# EasyEDA Pro project Propj-AlmuxCybernet.epro, board RPB2026PCB
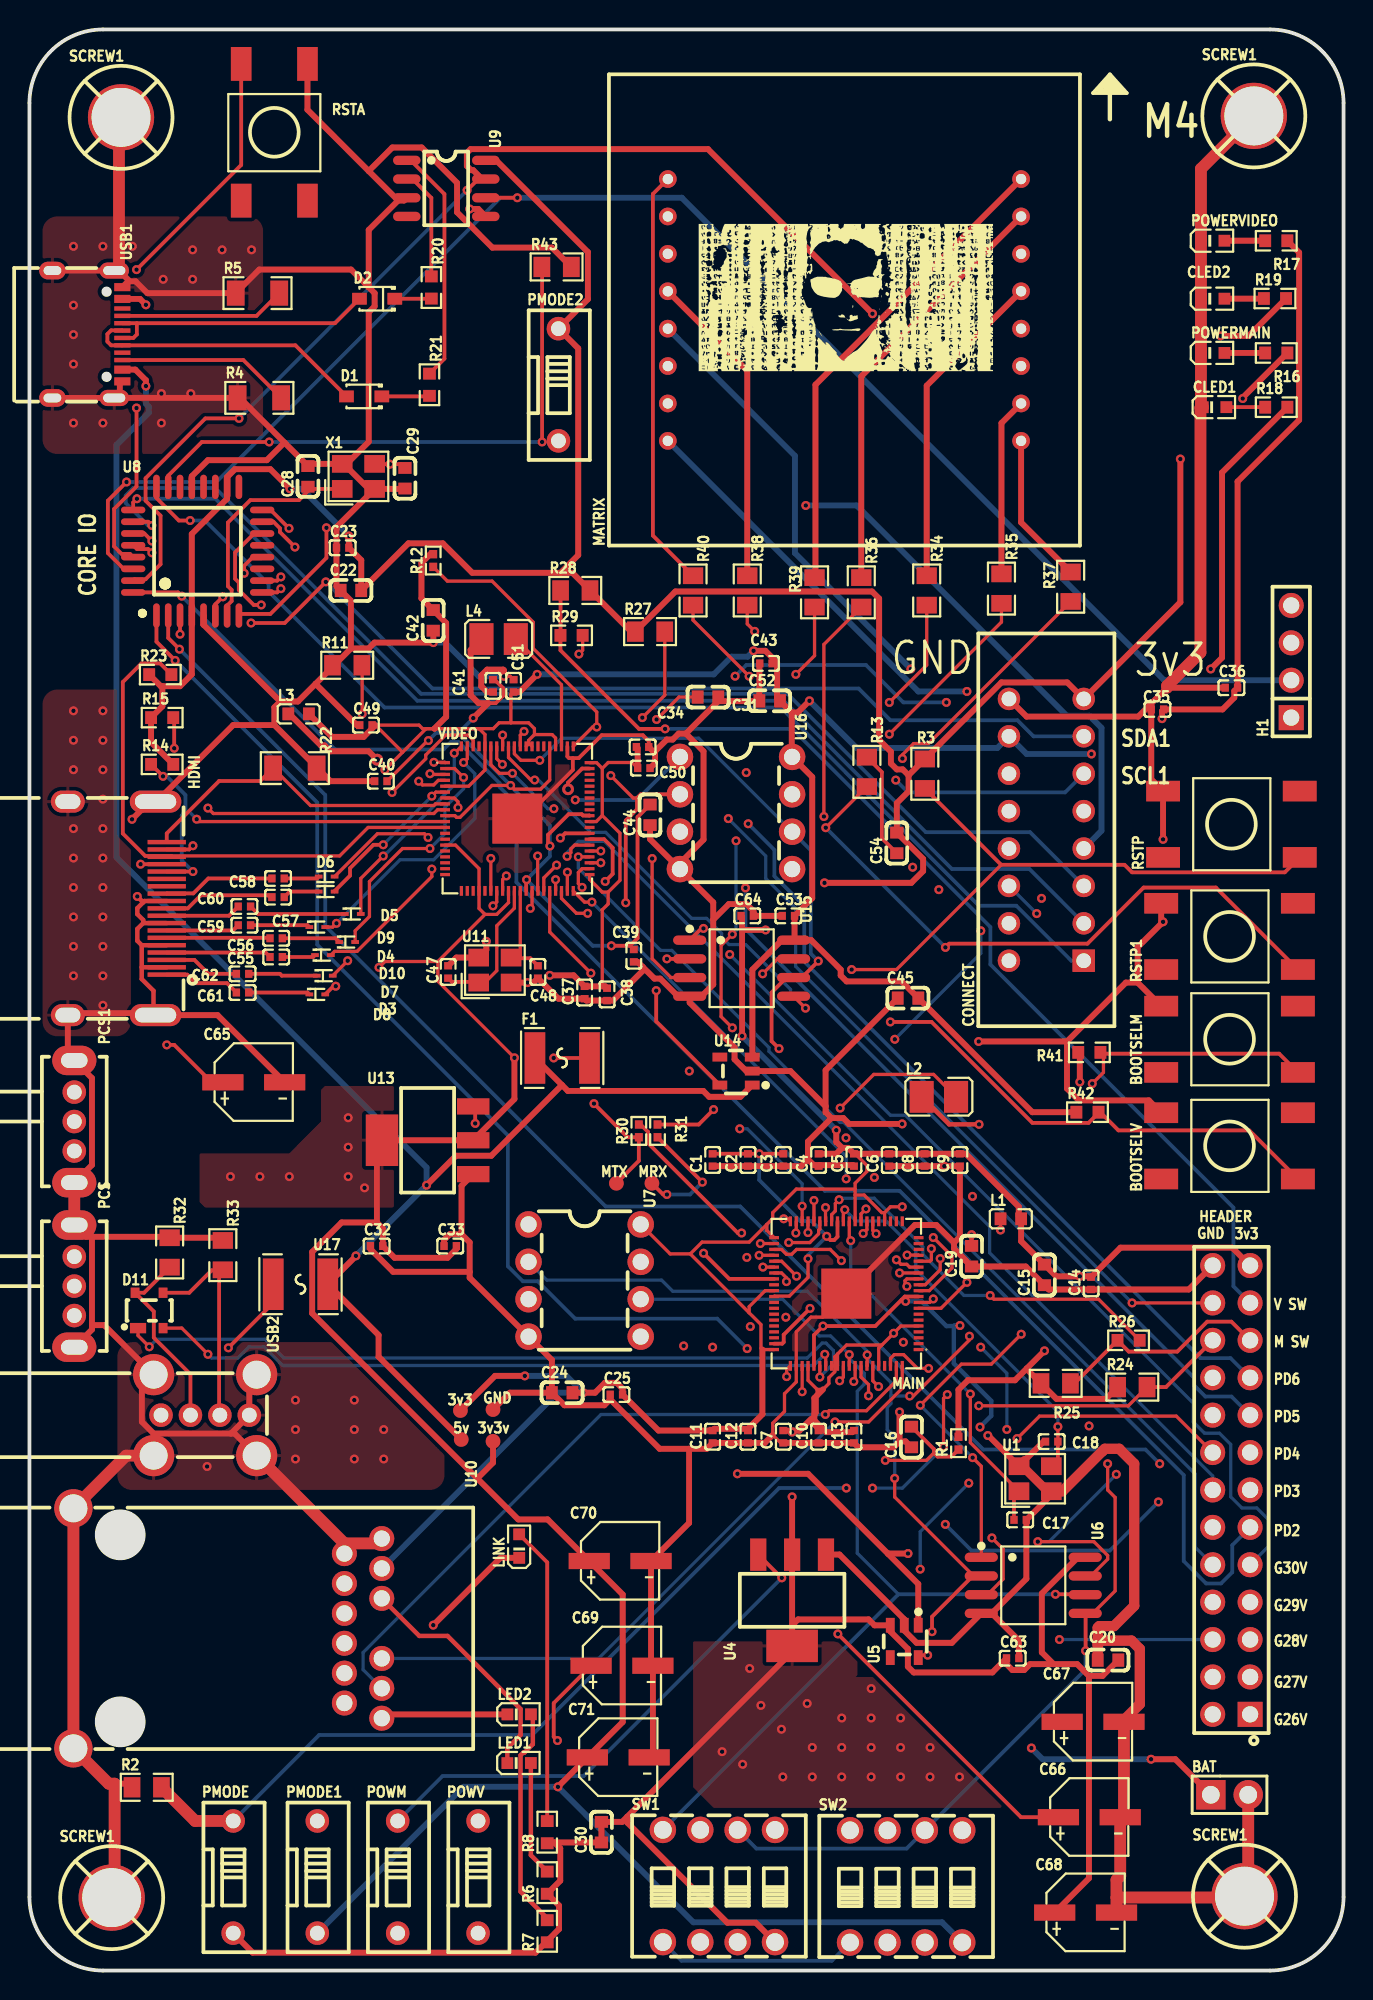
[diagram p2: board, top side]
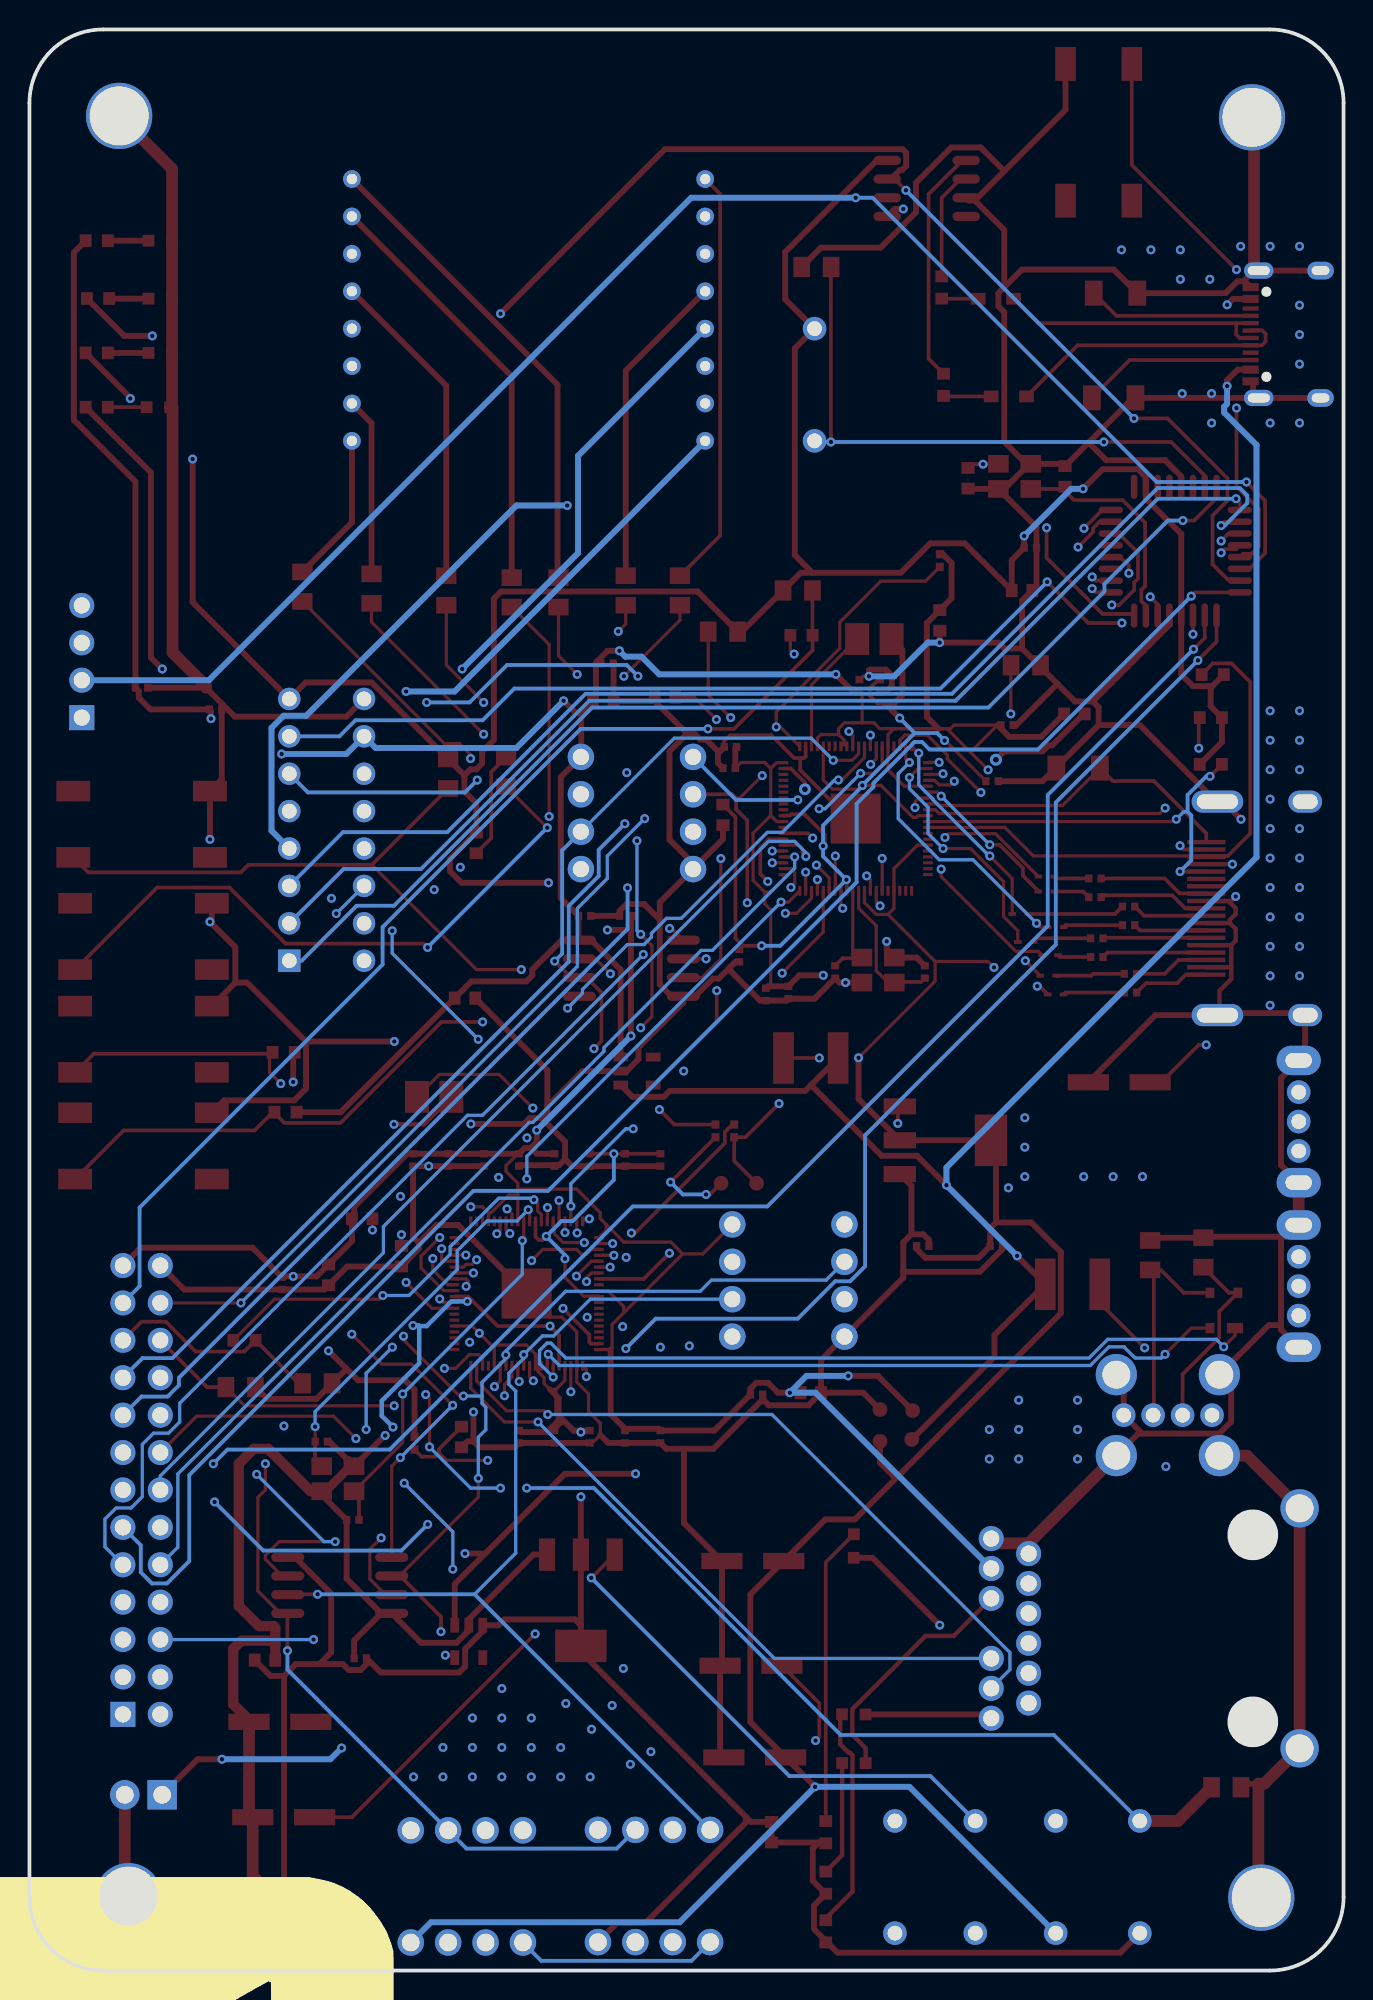
[diagram p3: board, bottom side, seen from below]

Outline 89.28 x 131.83 mm; copper layers: Top Layer, Inner1, Inner2, Inner3, Inner4, Bottom Layer. Coordinates in mm from the lower left corner of the outline.
Outline path: 0,126.83 0,5 arc(1.46,1.46) 5,0 84.28,0 arc(87.82,1.46) 89.28,5 89.28,126.83 arc(87.82,130.36) 84.28,131.83 5,131.83 arc(1.46,130.36) 0,126.83
Stack: Top Layer 0.035mm Outer layer thickness 1oz / Dielectric1 0.0994mm 3313 RC57% 4.2mil / Inner1 0.0152mm Inner layer thickness / Dielectric2 0.55mm 0.55mm H/H No copper / Inner2 0.0152mm Inner layer thickness / Dielectric3 0.1088mm 2116 RC54% 4.9mil / Inner3 0.0152mm Inner layer thickness / Dielectric4 0.55mm 0.55mm H/H No copper / Inner4 0.0152mm Inner layer thickness / Dielectric5 0.0994mm 3313 RC57% 4.2mil / Bottom Layer 0.035mm Outer layer thickness 1oz

## Design rules (mm)
template: Custom Config
spacing copperThickness1oz (default): track to track 0.102, other pairs 0.152 to 0.3
spacing copperThickness2oz: track to track 0.203, other pairs 0.152 to 0.3
track width copperThickness1oz (default): min 0.127, default 0.254, max 2.54
track width copperThickness2oz: min 0.203, default 0.254, max 2.54
track width Power: min 0.22, default 0.4, max 2.54
differential pair differentialPair (default): width min 0.127, default 0.254, max 2.54; gap min 0.152, default 0.152
via viaSize (default): diameter min 0.5, default 0.61, max 10; hole min 0.3, default 0.305, max 6.3
net GND uses Power
net 3V3 uses Power
net 3V3V uses Power
net +5V uses Power

## Placement (name value [footprint] x y rotation side)
3v3  -  [Test-Point-0.5mm]  29.28 38.03 0 top
3v3v  -  [Test-Point-0.5mm]  31.5 35.94 0 top
5v  -  [Test-Point-0.5mm]  29.34 36.07 0 top
BAT  PZ254V-11-02P  [HDR-TH_2P-P2.54-V-M]  81.53 11.94 0 top
BOOTSELM  K2-1102SP-A4SC-04  [KEY-SMD_4P-L6.0-W6.0-P4.50-LS10.0]  81.53 63.25 90 top
BOOTSELV  K2-1102SP-A4SC-04  [KEY-SMD_4P-L6.0-W6.0-P4.50-LS10.0]  81.53 56.01 90 top
C1  0.1u  [C0402]  46.42 55.05 90 top
C2  0.1u  [C0402]  48.82 55.05 90 top
C3  0.1u  [C0402]  51.22 55.05 90 top
C4  0.1u  [C0402]  53.62 55.05 90 top
C5  0.1u  [C0402]  56.02 55.05 90 top
C6  0.1u  [C0402]  58.42 55.05 90 top
C7  0.1u  [C0402]  51.22 36.25 90 top
C8  0.1u  [C0402]  60.82 55.05 90 top
C9  0.1u  [C0402]  63.22 55.05 90 top
C10  0.1u  [C0402]  53.62 36.25 90 top
C11  0.1u  [C0402]  46.42 36.25 90 top
C12  0.1u  [C0402]  48.82 36.25 90 top
C13  0.1u  [C0402]  56.02 36.25 90 top
C14  0.1u  [C0402]  72.13 46.67 90 top
C15  4.7u  [C0603]  68.96 47.24 90 top
C16  4.7u  [C0603]  59.92 36.24 90 top
C17  10p  [C0402]  67.31 30.61 180 top
C18  10p  [C0402]  69.45 35.92 0 top
C19  4.7uF  [C0603]  64.01 48.51 90 top
C20  4.7u  [C0603]  73.28 21.08 0 top
C22  4.7u  [C0603]  21.84 93.73 0 top
C23  0.1u  [C0402]  21.28 96.63 0 top
C24  4.7u  [C0603]  36.2 39.24 0 top
C25  0.1u  [C0402]  39.88 39.12 0 top
C28  15pF  [C0603]  18.92 101.47 90 top
C29  15pF  [C0603]  25.51 101.35 270 top
C30  4.7uF  [C0603]  38.86 9.4 90 top
C31  4.7u  [C0603]  46.1 86.49 180 top
C32  0.1u  [C0402]  23.59 49.2 0 top
C33  0.1u  [C0402]  28.59 49.2 0 top
C34  0.1u  [C0402]  41.66 83.1 180 top
C35  0.1u  [C0402]  76.64 85.65 0 top
C36  0.1u  [C0402]  81.66 87.12 0 top
C37  0.1u  [C0402]  37.72 66.42 90 top
C38  0.1u  [C0402]  39.24 66.29 90 top
C39  0.1u  [C0402]  41.06 68.92 90 top
C40  0.1u  [C0402]  23.88 80.77 0 top
C41  0.1u  [C0402]  31.5 87.25 90 top
C42  4.7u  [C0603]  27.43 91.69 90 top
C43  0.1u  [C0402]  50.04 88.77 0 top
C44  4.7uF  [C0603]  42.16 78.49 90 top
C45  4.7u  [C0603]  59.69 66.04 0 top
C47  10p  [C0402]  28.45 67.82 270 top
C48  10p  [C0402]  34.54 67.82 90 top
C49  0.1u  [C0402]  22.86 84.58 0 top
C50  0.1u  [C0402]  41.74 81.66 180 top
C51  0.1u  [C0402]  32.89 87.25 270 top
C52  4.7u  [C0603]  50.29 86.23 0 top
C53  0.1u  [C0402]  51.56 71.63 0 top
C54  4.7uF  [C0603]  58.93 76.58 90 top
C55  0.1uF  [C0402]  16.76 68.83 180 top
C56  0.1uF  [C0402]  16.76 70.1 180 top
C57  0.1uF  [C0402]  16.89 72.9 180 top
C58  0.1uF  [C0402]  16.89 74.17 180 top
C59  0.1uF  [C0402]  14.61 70.99 0 top
C60  0.1uF  [C0402]  14.61 72.26 0 top
C61  0.1uF  [C0402]  14.48 66.42 0 top
C62  0.1uF  [C0402]  14.48 67.69 0 top
C63  100nF  [C0402]  66.8 21.21 0 top
C64  100nF  [C0402]  48.77 71.63 0 top
C65  10uF  [CAP-SMD_BD5.0-L5.3-W5.3-FD]  15.24 60.33 0 top
C66  10uF  [CAP-SMD_BD5.0-L5.3-W5.3-FD]  72.01 10.41 0 top
C67  10uF  [CAP-SMD_BD5.0-L5.3-W5.3-FD]  72.26 16.89 0 top
C68  10uF  [CAP-SMD_BD5.0-L5.3-W5.3-FD]  71.76 3.94 0 top
C69  10uF  [CAP-SMD_BD5.0-L5.3-W5.3-FD]  40.26 20.7 0 top
C70  10uF  [CAP-SMD_BD5.0-L5.3-W5.3-FD]  40.13 27.81 0 top
C71  10uF  [CAP-SMD_BD5.0-L5.3-W5.3-FD]  40.01 14.48 0 top
CLED1  XL-1608UGC-04  [LED0603-RD_GREEN]  80.52 106.17 0 top
CLED2  XL-1608UGC-04  [LED0603-RD_GREEN]  80.39 113.54 0 top
CONNECT  ED16BGFBK  [CONN-TH_ED16BGFBK]  69.09 77.47 90 top
D1  SD05  [SOD-323_L1.8-W1.3-LS2.5-FD]  22.74 106.9 0 top
D2  SD05  [SOD-323_L1.8-W1.3-LS2.5-FD]  23.62 113.54 0 top
D3  ESD9L5.0ST5G  [SOD-923_L0.8-W0.6-LS1.0-RD]  19.94 68.96 0 top
D4  ESD9L5.0ST5G  [SOD-923_L0.8-W0.6-LS1.0-RD]  21.59 69.85 0 top
D5  ESD9L5.0ST5G  [SOD-923_L0.8-W0.6-LS1.0-RD]  20.19 73.28 0 top
D6  ESD9L5.0ST5G  [SOD-923_L0.8-W0.6-LS1.0-RD]  20.19 74.3 0 top
D7  ESD9L5.0ST5G  [SOD-923_L0.8-W0.6-LS1.0-RD]  20.07 67.56 0 top
D8  ESD9L5.0ST5G  [SOD-923_L0.8-W0.6-LS1.0-RD]  19.56 66.29 0 top
D9  ESD9L5.0ST5G  [SOD-923_L0.8-W0.6-LS1.0-RD]  21.97 71.75 0 top
D10  ESD9L5.0ST5G  [SOD-923_L0.8-W0.6-LS1.0-RD]  19.56 70.87 0 top
D11  PRTR5V0U2X  [SOT-143_L2.9-W1.3-P1.92-LS2.3-BL]  8.13 44.83 0 top
F1  MF-MSMF010-2  [F1812]  36.2 61.98 0 top
GND  -  [Test-Point-0.5mm]  31.5 38.1 0 top
H1  PZ254V-11-04P  [HDR-TH_4P-P2.54-V-M]  85.73 88.9 90 top
HDMI  HDMI-001S  [HDMI-SMD_HDMI-001S]  5.97 72.14 270 top
HEADER  PM254-2-13-Z-8.5  [HDR-TH_26P-P2.54-V-F-R2-C13-S2.54-1]  81.66 32.64 90 top
L1  600Ω  [L0603]  66.67 51.05 0 top
L2  3.3uH  [L1008]  61.79 59.33 0 top
L3  600Ω  [L0603]  18.29 85.34 0 top
L4  3.3uH  [L1008]  31.88 90.42 0 top
LED1  XL-1608UGC-04  [LED0603-RD_GREEN]  33.27 14.09 0 top
LED2  XL-1608UGC-04  [LED0603-RD_GREEN]  33.27 17.4 0 top
LINK  XL-1608UGC-04  [LED0603-RD_GREEN]  33.27 28.83 90 top
MAIN  RP2350B  [QFN-80_L10.0-W10.0-P0.40-TL-EP3.4]  55.5 45.97 180 top
MATRIX  SZ421288N/64  [LED-SEG-TH_SZ421288N-64]  55.37 112.78 90 top
MRX  -  [Test-Point-0.5mm]  42.29 53.47 0 top
MTX  -  [Test-Point-0.5mm]  39.88 53.47 0 top
PCS  SK12D07VG5  [SW-TH_SK12D07VG5-1]  3.05 46.48 270 top
PCS1  SK12D07VG5  [SW-TH_SK12D07VG5-1]  3.05 57.66 270 top
PMODE  DSWB01LHGET  [SW-TH_DSWB01LHGET]  13.84 6.35 0 top
PMODE1  DSWB01LHGET  [SW-TH_DSWB01LHGET]  19.56 6.35 0 top
PMODE2  DSWB01LHGET  [SW-TH_DSWB01LHGET]  35.94 107.7 0 top
POWERMAIN  XL-1608UGC-04  [LED0603-RD_GREEN]  80.39 109.86 0 top
POWERVIDEO  XL-1608UGC-04  [LED0603-RD_GREEN]  80.39 117.47 0 top
POWM  DSWB01LHGET  [SW-TH_DSWB01LHGET]  25.02 6.35 0 top
POWV  DSWB01LHGET  [SW-TH_DSWB01LHGET]  30.48 6.35 0 top
R1  33  [R0402]  63.12 35.81 90 top
R2  10kΩ  [R0805]  7.97 12.45 0 top
R3  10kΩ  [R0805]  60.83 81.28 270 top
R4  5.1kΩ  [R1206]  15.62 106.81 0 top
R5  5.1kΩ  [R1206]  15.49 113.92 0 top
R6  330Ω  [R0603]  35.18 5.97 90 top
R7  330Ω  [R0603]  35.18 2.67 90 top
R8  330Ω  [R0603]  35.18 9.4 90 top
R11  10kΩ  [R0805]  21.59 88.65 0 top
R12  33Ω  [R0402]  27.43 95.76 90 top
R13  10kΩ  [R0805]  56.9 81.41 270 top
R14  4.7kΩ  [R0603]  9.02 81.92 0 top
R15  4.7kΩ  [R0603]  9.02 85.09 0 top
R16  330Ω  [R0603]  84.71 109.86 180 top
R17  330Ω  [R0603]  84.71 117.47 180 top
R18  330Ω  [R0603]  84.71 106.17 0 top
R19  330Ω  [R0603]  84.62 113.55 0 top
R20  22Ω  [R0603]  27.31 114.3 270 top
R21  22Ω  [R0603]  27.18 107.7 270 top
R22  100kΩ  [R1206]  18.03 81.66 180 top
R23  4.7kΩ  [R0603]  8.89 88.01 0 top
R24  10kΩ  [R0805]  74.93 39.62 0 top
R25  10kΩ  [R0805]  69.72 39.88 180 top
R26  33Ω  [R0603]  74.68 42.8 0 top
R27  10kΩ  [R0805]  42.16 90.93 0 top
R28  10kΩ  [R0805]  37.08 93.73 0 top
R29  33Ω  [R0603]  36.83 90.68 0 top
R30  33Ω  [R0402]  41.4 57.02 90 top
R31  33Ω  [R0402]  42.67 57.02 90 top
R32  15kΩ  [R0805]  9.53 48.77 270 top
R33  15kΩ  [R0805]  13.14 48.58 270 top
R34  150Ω  [R0805]  60.96 93.73 270 top
R35  150Ω  [R0805]  66.04 93.85 270 top
R36  150Ω  [R0805]  56.52 93.6 270 top
R37  150Ω  [R0805]  70.74 93.98 270 top
R38  150Ω  [R0805]  48.77 93.73 270 top
R39  150Ω  [R0805]  53.34 93.6 270 top
R40  150Ω  [R0805]  45.08 93.73 270 top
R41  1kΩ  [R0603]  72.01 62.36 0 top
R42  1kΩ  [R0603]  71.88 58.29 0 top
R43  10kΩ  [R0805]  35.81 115.7 0 top
RSTA  K2-1102SP-A4SC-04  [KEY-SMD_4P-L6.0-W6.0-P4.50-LS10.0]  16.64 124.84 0 top
RSTP  K2-1102SP-A4SC-04  [KEY-SMD_4P-L6.0-W6.0-P4.50-LS10.0]  81.66 77.85 90 top
RSTP1  K2-1102SP-A4SC-04  [KEY-SMD_4P-L6.0-W6.0-P4.50-LS10.0]  81.53 70.23 90 top
SCREW1  -  [Screw-Hole-M4]  6.22 125.86 0 top
SCREW1#2  -  [Screw-Hole-M4]  83.18 125.95 0 top
SCREW1#3  -  [Screw-Hole-M4]  82.55 5.05 0 top
SCREW1#4  -  [Screw-Hole-M4]  5.59 4.95 0 top
SW1  DSWB04LHGET  [SW-TH_DSWB04LHGET]  46.85 5.74 0 top
SW2  DSWB04LHGET  [SW-TH_DSWB04LHGET]  59.56 5.72 0 top
U1  3225-16M-SR  [CRYSTAL-SMD_4P-L3.2-W2.5-BL]  68.33 33.4 0 top
U4  TLV1117LV33DCYR  [SOT-223_L6.7-W3.5-P2.30-BR]  51.82 25.15 90 top
U5  TLV73311PDBVR  [SOT-23-5_L2.9-W1.6-P0.95-LS2.8-BR]  59.44 22.35 90 top
U6  W25Q16JVSSIQ  [SOIC-8_L5.3-W5.3-P1.27-LS8.0-BL]  68.2 26.16 270 top
U7  23LCV1024-I/P  [PDIP-8_L9.3-W6.4-P2.54-LS7.6-BL]  37.72 46.86 270 top
U8  ATMEGA328PB-AU  [TQFP-32_L7.0-W7.0-P0.80-LS9.0-BL]  11.43 96.39 0 top
U9  CH340N  [SOP-8_L4.9-W3.9-P1.27-LS6.0-BL]  28.32 121.03 270 top
U10  USR-K6  [COMM_USR-K6]  13.46 23.24 270 top
U11  3225-16M-SR  [CRYSTAL-SMD_4P-L3.2-W2.5-BL]  31.62 67.95 0 top
U13  TLV1117LV33DCYR  [SOT-223_L6.7-W3.5-P2.30-BR]  27.05 56.39 0 top
U14  TLV73311PDBVR  [SOT-23-5_L2.9-W1.6-P0.95-LS2.8-BR]  48.01 61.09 0 top
U15  W25Q16JVSSIQ  [SOIC-8_L5.3-W5.3-P1.27-LS8.0-BL]  48.39 68.07 270 top
U16  23LCV1024-I/P  [PDIP-8_L9.3-W6.4-P2.54-LS7.6-BL]  48.01 78.61 270 top
U17  MF-MSMF050-2  [F1812]  18.42 46.61 180 top
USB1  TYPE-C 16PIN 2MD(073)  [USB-C-SMD_TYPE-C-6PIN-2MD-073]  3.94 111.12 270 top
USB2  USB-226-BRY  [USB-A-TH_USB-226-BRY]  11.94 37.72 270 top
VIDEO  RP2350B  [QFN-80_L10.0-W10.0-P0.40-TL-EP3.4]  33.15 78.23 0 top
X1  8MHz  [CRYSTAL-SMD_4P-L3.2-W2.5-BL]  22.35 101.47 0 top

## Footprints (pads in the part's own frame, mm; a bottom-side part is the same pattern mirrored in y, then rotated)
C0402
  rect 0.5x0.54 smd: 1(-0.42,0) 2(0.42,0)
C0603
  rect 0.8x0.9 smd: 1(-0.7,0) 2(0.7,0)
CAP-SMD_BD5.0-L5.3-W5.3-FD
  rect 2.8x1.1 smd: 1(-2.1,0) 2(2.1,0)
COMM_USR-K6
  round 1.7 hole 1.1: 1(5.075,7.935) 2(3.045,7.935) 3(1.015,7.935) 4(-1.015,7.935) 5(-3.045,7.935) 6(-5.075,7.935) 7(6.105,10.475) 8(4.075,10.475) 9(2.045,10.475) 10(-2.035,10.475) 11(-4.065,10.475) 12(-6.095,10.475)
  round 2.6 hole 1.9: 13(-8.15,-10.475) 14(8.15,-10.475)
CONN-TH_ED16BGFBK
  rect 1.524x1.524 hole 1: 1(-8.89,-2.54)
  round 1.524 hole 1: 2(-6.35,-2.54) 3(-3.81,-2.54) 4(-1.27,-2.54) 5(1.27,-2.54) 6(3.81,-2.54) 7(6.35,-2.54) 8(8.89,-2.54) 9(8.89,2.54) 10(6.35,2.54) 11(3.81,2.54) 12(1.27,2.54) 13(-1.27,2.54) 14(-3.81,2.54) 15(-6.35,2.54) 16(-8.89,2.54)
CRYSTAL-SMD_4P-L3.2-W2.5-BL
  rect 1.4x1.2 smd: 1(-1.1,-0.85) 2(1.1,-0.85) 3(1.1,0.85) 4(-1.1,0.85)
F1812
  rect 1.407x3.499 smd: 1(-1.853,0) 2(1.853,0)
HDMI-SMD_HDMI-001S
  rect 0.3x2.6 smd: 1(4.5,3.36) 2(4,3.36) 3(3.5,3.36) 4(3,3.36) 5(2.5,3.36) 6(2,3.36) 7(1.5,3.36) 8(1,3.36) 9(0.5,3.36) 10(0,3.36) 11(-0.5,3.36) 12(-1,3.36) 13(-1.5,3.36) 14(-2,3.36) 15(-2.5,3.36) 16(-3,3.36) 17(-3.5,3.36) 18(-4,3.36) 19(-4.5,3.36)
  oval 1.5x3.5 hole 1x2.8: 20(-7.25,2.6) 21(7.25,2.6)
  oval 1.5x2.3 hole 1x1.7: 22(-7.25,-3.36) 23(7.25,-3.36)
HDR-TH_2P-P2.54-V-M
  rect 2x2 hole 1.2: 1(-1.27,0)
  round 2 hole 1.2: 2(1.27,0)
HDR-TH_4P-P2.54-V-M
  rect 1.7x1.7 hole 1.1: 1(-3.81,0)
  round 1.7 hole 1.1: 2(-1.27,0) 3(1.27,0) 4(3.81,0)
HDR-TH_26P-P2.54-V-F-R2-C13-S2.54-1
  rect 1.7x1.7 hole 1.1: 1(-15.24,-1.27)
  round 1.7 hole 1.1: 2(-15.24,1.27) 3(-12.7,-1.27) 4(-12.7,1.27) 5(-10.16,-1.27) 6(-10.16,1.27) 7(-7.62,-1.27) 8(-7.62,1.27) 9(-5.08,-1.27) 10(-5.08,1.27) 11(-2.54,-1.27) 12(-2.54,1.27) 13(0,-1.27) 14(0,1.27) 15(2.54,-1.27) 16(2.54,1.27) 17(5.08,-1.27) 18(5.08,1.27) 19(7.62,-1.27) 20(7.62,1.27) 21(10.16,-1.27) 22(10.16,1.27) 23(12.7,-1.27) 24(12.7,1.27) 25(15.24,-1.27) 26(15.24,1.27)
KEY-SMD_4P-L6.0-W6.0-P4.50-LS10.0
  rect 1.4x2.3 smd: 1(-2.25,-4.643) 2(-2.25,4.643) 3(2.25,4.643) 4(2.25,-4.643)
L0603
  rect 0.8x0.864 smd: 1(-0.7,0) 2(0.7,0)
L1008
  rect 1.635x2.16 smd: 1(-1.167,0) 2(1.167,0)
LED0603-RD_GREEN
  rect 0.8x0.8 smd: 1(-0.799,-0.004) 2(0.799,0.004)
LED-SEG-TH_SZ421288N-64
  round 1.2 hole 0.7: 1(-8.89,-12) 2(-6.35,-12) 3(-3.81,-12) 4(-1.27,-12) 5(1.27,-12) 6(3.81,-12) 7(6.35,-12) 8(8.89,-12) 9(8.89,12) 10(6.35,12) 11(3.81,12) 12(1.27,12) 13(-1.27,12) 14(-3.81,12) 15(-6.35,12) 16(-8.89,12)
PDIP-8_L9.3-W6.4-P2.54-LS7.6-BL
  round 1.8 hole 1.1: 1(-3.81,-3.81) 2(-1.27,-3.81) 3(1.27,-3.81) 4(3.81,-3.81) 5(3.81,3.81) 6(1.27,3.81) 7(-1.27,3.81) 8(-3.81,3.81)
QFN-80_L10.0-W10.0-P0.40-TL-EP3.4
  rect 0.665x0.22 smd: 1(-4.907,3.8) 2(-4.907,3.4) 3(-4.907,3) 4(-4.907,2.6) 5(-4.907,2.2) 6(-4.907,1.8) 7(-4.907,1.4) 8(-4.907,1) 9(-4.907,0.6) 10(-4.907,0.2) 11(-4.907,-0.2) 12(-4.907,-0.6) 13(-4.907,-1) 14(-4.907,-1.4) 15(-4.907,-1.8) 16(-4.907,-2.2) 17(-4.907,-2.6) 18(-4.907,-3) 19(-4.907,-3.4) 20(-4.907,-3.8) 41(4.907,-3.8) 42(4.907,-3.4) 43(4.907,-3) 44(4.907,-2.6) 45(4.907,-2.2) 46(4.907,-1.8) 47(4.907,-1.4) 48(4.907,-1) 49(4.907,-0.6) 50(4.907,-0.2) 51(4.907,0.2) 52(4.907,0.6) 53(4.907,1) 54(4.907,1.4) 55(4.907,1.8) 56(4.907,2.2) 57(4.907,2.6) 58(4.907,3) 59(4.907,3.4) 60(4.907,3.8)
  rect 0.22x0.665 smd: 21(-3.8,-4.907) 22(-3.4,-4.907) 23(-3,-4.907) 24(-2.6,-4.907) 25(-2.2,-4.907) 26(-1.8,-4.907) 27(-1.4,-4.907) 28(-1,-4.907) 29(-0.6,-4.907) 30(-0.2,-4.907) 31(0.2,-4.907) 32(0.6,-4.907) 33(1,-4.907) 34(1.4,-4.907) 35(1.8,-4.907) 36(2.2,-4.907) 37(2.6,-4.907) 38(3,-4.907) 39(3.4,-4.907) 40(3.8,-4.907) 61(3.8,4.907) 62(3.4,4.907) 63(3,4.907) 64(2.6,4.907) 65(2.2,4.907) 66(1.8,4.907) 67(1.4,4.907) 68(1,4.907) 69(0.6,4.907) 70(0.2,4.907) 71(-0.2,4.907) 72(-0.6,4.907) 73(-1,4.907) 74(-1.4,4.907) 75(-1.8,4.907) 76(-2.2,4.907) 77(-2.6,4.907) 78(-3,4.907) 79(-3.4,4.907) 80(-3.8,4.907)
  rect 3.4x3.4 smd: 81(0,0)
R0402
  rect 0.566x0.54 smd: 1(-0.433,0) 2(0.433,0)
R0603
  rect 0.806x0.864 smd: 1(-0.753,0) 2(0.753,0)
R0805
  rect 1.133x1.377 smd: 1(-1,0) 2(1,0)
R1206
  rect 1.208x1.701 smd: 1(-1.479,0) 2(1.479,0)
Screw-Hole-M4
  round 4.5 hole 4: 1(0,0)
SOD-323_L1.8-W1.3-LS2.5-FD
  rect 1x0.8 smd: 1(-1.2,0) 2(1.2,0)
SOD-923_L0.8-W0.6-LS1.0-RD
  rect 0.52x0.26 smd: 1(-0.54,0) 2(0.54,0)
SOIC-8_L5.3-W5.3-P1.27-LS8.0-BL
  oval 0.63x2.25 smd: 1(-1.905,-3.53) 2(-0.635,-3.53) 3(0.635,-3.53) 4(1.905,-3.53) 5(1.905,3.53) 6(0.635,3.53) 7(-0.635,3.53) 8(-1.905,3.53)
SOP-8_L4.9-W3.9-P1.27-LS6.0-BL
  oval 0.63x1.865 smd: 1(-1.905,-2.683) 2(-0.635,-2.683) 3(0.635,-2.683) 4(1.905,-2.683) 5(1.905,2.683) 6(0.635,2.683) 7(-0.635,2.683) 8(-1.905,2.683)
SOT-23-5_L2.9-W1.6-P0.95-LS2.8-BR
  rect 1x0.6 smd: 1(1.1,-0.95) 2(1.1,0) 3(1.1,0.95) 4(-1.1,0.95) 5(-1.1,-0.95)
SOT-143_L2.9-W1.3-P1.92-LS2.3-BL
  rect 1.1x0.7 smd: 1(-0.75,-1.2)
  rect 0.6x0.7 smd: 2(0.95,-1.2) 3(0.95,1.2) 4(-0.95,1.2)
SOT-223_L6.7-W3.5-P2.30-BR
  rect 2.2x1.1 smd: 1(3.099,-2.3) 2(3.099,0) 3(3.099,2.3)
  rect 2.2x3.5 smd: 4(-3.099,0)
SW-TH_DSWB01LHGET
  round 1.6 hole 1: 1(0,3.81) 2(0,-3.81)
SW-TH_DSWB04LHGET
  round 1.8 hole 1.2: 1(-3.81,3.81) 2(-1.27,3.81) 3(1.27,3.81) 4(3.81,3.81) 5(-3.81,-3.81) 6(-1.27,-3.81) 7(1.27,-3.81) 8(3.81,-3.81)
SW-TH_SK12D07VG5-1
  oval 1.6x1.6 hole 1: 1(-2,0) 2(0,0) 3(2,0)
  oval 2x3 hole 1x1.8: 4(4.15,0) 5(-4.15,0)
Test-Point-0.5mm
  round 1 smd: 1(0,0)
TQFP-32_L7.0-W7.0-P0.80-LS9.0-BL
  oval 0.45x1.65 smd: 1(-2.8,-4.369) 2(-2,-4.369) 3(-1.2,-4.369) 4(-0.4,-4.369) 5(0.4,-4.369) 6(1.2,-4.369) 7(2,-4.369) 8(2.8,-4.369) 17(2.8,4.369) 18(2,4.369) 19(1.2,4.369) 20(0.4,4.369) 21(-0.4,4.369) 22(-1.2,4.369) 23(-2,4.369) 24(-2.8,4.369)
  oval 1.65x0.45 smd: 9(4.381,-2.8) 10(4.381,-2) 11(4.381,-1.2) 12(4.381,-0.4) 13(4.381,0.4) 14(4.381,1.2) 15(4.381,2) 16(4.381,2.8) 25(-4.381,2.8) 26(-4.381,2) 27(-4.381,1.2) 28(-4.381,0.4) 29(-4.381,-0.4) 30(-4.381,-1.2) 31(-4.381,-2) 32(-4.381,-2.8)
USB-A-TH_USB-226-BRY
  round 1.6 hole 1: 1(0,-3) 2(0,-1) 3(0,1) 4(0,2.999)
  round 2.8 hole 1.9: 5(-2.75,3.5) 5(-2.75,-3.5) 5(2.75,3.5) 5(2.75,-3.5)
USB-C-SMD_TYPE-C-6PIN-2MD-073
  rect 0.55x1.1 smd: 1(-3.2,2.375) 2(-2.4,2.375) 11(2.4,2.375) 12(3.2,2.375)
  rect 0.3x1.1 smd: 3(-1.75,2.375) 4(-1.25,2.375) 5(-0.75,2.375) 6(-0.25,2.375) 7(0.25,2.375) 8(0.75,2.375) 9(1.25,2.375) 10(1.75,2.375)
  oval 1.1x2 hole 0.6x1.5: 13(-4.325,1.825) 14(4.325,1.825)
  oval 1.2x1.8 hole 0.6x1.2: 13(-4.325,-2.375) 14(4.325,-2.375)

## Nets
As in the schematic, except:
3V3: 3v3.1 C4.2 C5.2 C6.2 C7.2 C8.2 C9.2 C10.2 C11.2 C12.2 C13.2 C14.2 C15.2 C20.2 C22.2 C23.2 C24.2 C25.2 C30.1 C30.2 C54.2 C63.1 C64.1 C68.1 CONNECT.8 HEADER.25 L1.2 MAIN.5 MAIN.15 MAIN.24 MAIN.29 MAIN.41 MAIN.50 MAIN.60 MAIN.64 MAIN.68 MAIN.69 MAIN.76 PMODE.2 PMODE2.1 R1.2 R3.1 R6.1 R7.1 R8.1 R14.2 R15.1 R16.1 R23.1 R24.1 R25.2 R27.1 R28.2 R41.1 SW1.8 U4.2 U4.4 U5.3 U6.8 U7.8 U8.4 U8.18 U9.8 U10.11
GND: BAT.2 BOOTSELM.3 BOOTSELV.3 C1.1 C2.1 C3.1 C4.1 C5.1 C6.1 C7.1 C8.1 C9.1 C10.1 C11.1 C12.1 C13.1 C14.1 C15.1 C16.1 C17.1 C18.1 C19.1 C20.1 C22.1 C23.1 C24.1 C25.1 C28.2 C29.2 C31.1 C32.1 C33.1 C34.1 C35.1 C36.1 C37.1 C38.1 C39.1 C40.1 C41.1 C42.1 C43.1 C44.1 C45.1 C47.1 C48.1 C49.1 C50.1 C51.1 C52.1 C53.1 C63.2 C64.2 C65.2 C66.2 C67.2 C68.2 C69.2 C70.2 C71.2 CLED1.1 CLED2.1 CONNECT.9 GND.1 HDMI.2 HDMI.5 HDMI.8 HDMI.11 HDMI.20 HDMI.21 HDMI.22 HDMI.23 HEADER.26 MAIN.62 MAIN.81 PCS.4 PCS.5 PCS1.4 PCS1.5 POWERMAIN.1 POWERVIDEO.1 R2.1 R4.1 R5.1 R11.1 R22.1 R32.1 R33.1 R43.2 RSTA.3 RSTP.3 RSTP1.3 SCREW1.1 SCREW1#2.1 SCREW1#3.1 SCREW1#4.1 U1.2 U1.4 U4.1 U5.2 U6.4 U7.4 U8.5 U8.21 U9.3 U10.6 U10.12 U10.13 U10.14 U11.2 U11.4 U13.1 U14.2 U15.4 U16.4 USB1.1 USB1.12 USB1.13 USB1.14 USB2.4 USB2.5 VIDEO.62 VIDEO.81 X1.2 X1.4
GPIO26V: HEADER.1 VIDEO.27
GPIO27V: HEADER.3 VIDEO.28
GPIO28V: HEADER.5 VIDEO.36
GPIO29V: HEADER.7 VIDEO.37
GPIO30V: HEADER.9 VIDEO.38
GPIO31V: HEADER.2 VIDEO.39
GPIO32V: HEADER.4 VIDEO.40
GPIO33V: HEADER.6 VIDEO.42
GPIO34V: HEADER.8 VIDEO.43
GPIO35: HEADER.16 MAIN.44
GPIO35V: HEADER.10 VIDEO.44
GPIO36: HEADER.18 MAIN.45
GPIO36V: HEADER.12 VIDEO.45
GPIO37: HEADER.20 MAIN.46
GPIO37V: HEADER.14 VIDEO.46
PD2: HEADER.11 U8.32
PD3: HEADER.13 U8.1
PD4: HEADER.15 U8.2
PD5: HEADER.17 U8.9
PD6: HEADER.19 U8.10
SWCLK: HEADER.21 R25.1 R26.1
SWCLKV: HEADER.23 R28.1 R29.1
SWDIO: HEADER.22 MAIN.34 R24.2
SWDIOV: HEADER.24 R27.2 VIDEO.34

Pads without a net: BOOTSELM 2 4; BOOTSELV 2 4; C67 1; H1 3 4; HDMI 13 14; RSTA 1 4; RSTP 2 4; RSTP1 2 4; U5 4; U7 3 7; U8 11 13 17 19 20 22; U9 4; U10 1 2 4 5; U14 4; U16 3 7; USB1 3 9

## Via types
v1: diameter 0.61, hole 0.305, Top Layer to Bottom Layer, 374 vias
v2: diameter 0.81, hole 0.405, Top Layer to Bottom Layer, 1 via
v3: diameter 0.8, hole 0.4, Top Layer to Bottom Layer, 1 via

## Routing (per net, layer and track width the routed paths; a pad name or vN(x,y) marks a point on that pad's centre or on a via; arc(x,y) is an arc through that point)
1V1: length 89.4
  Top Layer w0.22: v1(52.9,48.34) 52.9,47.07 51.63,45.8 50.62,45.8 MAIN.51 ; 59.25,45.55 59.34,45.45 v1(59.53,45.45) ; v1(61.02,21.42) 60.55,21.42 U5.5
  Top Layer w0.254: 46.42,55.47 v1(49.58,55.47) 51.22,55.47 ; MAIN.10 59.47,45.77 57.47,43.77 v1(53.91,43.77) 53.3,43.16 MAIN.65 ; v1(54.17,49.87) 54.42,49.61 54.67,49.61 54.9,49.84 MAIN.32
  Top Layer w0.3: v1(64.52,57.47) 62.48,57.47 L2.1 ; v1(64.01,49.98) C19.2
  Inner1 w0.22: v1(61.02,21.42) 60.52,21.93 v1(60.52,27.26)
  Inner1 w0.254: v1(52.9,48.34) 52.9,45.8 52.39,45.29 52.39,44.79 53.4,43.77 v1(53.91,43.77)
  Inner1 w0.3: v1(63.22,43.81) 63.22,46.35 63.08,46.48 63.08,46.99 63.18,47.09 63.18,48.9 64.01,49.72 v1(64.01,49.98)
  Inner4 w0.22: v1(63.82,33.1) 65.85,35.13 65.85,36.4 65.34,36.91 v1(64.58,36.91)
  Inner4 w0.3: v1(64.01,49.98) 64.77,50.74 64.77,57.21 v1(64.52,57.47)
  Bottom Layer w0.22: v1(63.82,33.1) 60.52,29.8 v1(60.52,27.26)
  Bottom Layer w0.254: v1(52.9,48.34) 52.9,48.6 v1(54.17,49.87) 53.13,50.9 52.37,50.9 49.58,53.69 v1(49.58,55.47)
  Bottom Layer w0.3: v1(64.58,36.91) 65.34,37.67 65.34,38.69 62.8,41.23 62.8,43.77 ; 62.8,43.77 62.84,43.81 v1(63.22,43.81) ; 62.8,43.77 62.3,43.77 60.61,45.45 v1(59.53,45.45)
1V1V: length 78.1
  Top Layer w0.22: VIDEO.10 28.9,78.43 29.02,78.32 29.25,78.32 31.42,80.49 v1(32.69,80.49) 32.95,80.23 34.73,80.23 35.35,80.85 VIDEO.65 ; C39.2 40.81,69.6 ; v1(27.11,83.53) 27.06,83.53 C40.2
  Top Layer w0.254: U14.5 42.58,64.46 v1(42.58,66.55) ; VIDEO.32 33.75,74.06 v1(33.78,74.09) ; v1(39.54,69.6) 40.81,69.6 41.31,70.1 41.31,78.34 C44.2 ; VIDEO.51 38.04,78.44 37.61,78.44 37.52,78.53 36.63,78.53 35.23,77.13 35.23,76.5 v1(35.36,76.37) ; 31.17,86.07 31.68,86.07 32.18,86.58 32.18,87.09 31.68,87.6 31.57,87.6 C41.2
  Top Layer w0.4: L4.1 29.97,89.69 29.97,86.61 30.51,86.07 31.17,86.07 v1(30.15,85.06)
  Inner1 w0.254: v1(39.54,69.6) v1(42.58,66.55)
  Bottom Layer w0.254: 29.14,84.04 v1(32.69,80.49) 32.69,80.44 35.36,77.77 v1(35.36,76.37) 35.36,75.67 v1(33.78,74.09) 38.27,69.6 v1(39.54,69.6) ; 29.14,84.04 27.61,84.04 v1(27.11,83.53) ; 29.14,84.04 v1(30.15,85.06)
3V3: length 550.4
  Top Layer w0.22: 50.1,50.67 50.5,51.07 50.5,51.47 52.1,53.07 56.1,53.07 ; 50.1,50.67 48.9,49.47 45.7,49.47 44.9,48.67 ; 50.1,50.67 50.1,50.27 MAIN.41 ; 48.9,44.67 48.9,45.09 49.98,46.17 MAIN.50 ; 48.9,44.67 49.7,43.87 49.7,42.27 49.8,42.17 MAIN.60 ; 48.9,44.67 44.9,48.67 ; MAIN.76 57.7,42.27 57.91,42.48 ; 58.1,51.47 MAIN.24 ; 58.1,51.47 57.91,51.47 56.71,52.67 56.1,52.67 ; 58.1,51.47 58.5,51.87 v1(59.3,51.87) ; 56.1,53.07 56.1,52.67 ; 56.1,53.07 56.1,53.47 56.9,54.27 56.9,54.67 56.1,55.47 ; 56.1,52.67 MAIN.29 ; 54.71,41.07 54.71,40.67 54.31,40.27 54.31,39.87 53.91,39.47 53.51,39.47 ; 54.71,41.07 MAIN.69 54.9,41.87 ; 54.71,41.07 MAIN.68 ; 54.71,41.07 54.71,41.68 54.9,41.87 ; 44.9,48.67 43.53,48.67 U7.8 ; 57.91,42.48 v1(58.71,43.28) 59.21,43.77 MAIN.5 ; 57.91,42.48 55.51,42.48 54.9,41.87 ; v1(58.9,48.27) 59.21,47.96 59.61,47.96 59.8,47.77 MAIN.15 ; 53.51,39.47 52.9,40.08 MAIN.64 ; 53.51,39.47 53.51,37.87 53.11,37.47 53.11,37.18 C10.2
  Top Layer w0.4: R23.1 8.92,87.22 9.03,87.22 ; 67.76,40.89 66.96,40.09 63.76,40.09 63.12,39.45 R1.2 ; 67.76,40.89 67.76,40.84 R25.2 69.78,38.82 73.13,38.82 R24.1 ; 67.76,40.89 v1(68.96,42.09) ; 48.82,36.79 C12.2 ; 48.82,36.79 49.8,37.77 49.8,42.17 ; 48.82,36.79 46.54,36.79 C11.2 42.74,36.67 C25.2 40.3,39.52 39.9,39.92 39.1,39.92 38.42,39.24 v1(37.62,39.24) C24.2 ; 48.42,70.67 48.42,71.56 C64.1 ; 48.42,70.67 v1(50.02,70.67) ; 48.42,70.67 v1(48.42,63.47) ; 35.18,2.02 35.98,2.82 35.98,4.42 R6.1 36.06,6.1 36.06,8.3 35.66,8.7 ; 35.18,2.02 R7.1 ; 35.18,2.02 34.38,1.22 15.17,1.22 PMODE.2 ; 51.82,23.44 U4.4 51.82,21.65 40.62,10.45 ; 51.82,23.44 U4.2 v1(51.82,32.17) ; 51.82,23.44 52.22,23.84 57.02,23.84 57.42,23.44 58.48,23.44 ; C68.1 71.98,6.26 71.98,20.01 ; C13.2 55.91,36.56 54.12,36.56 53.33,37.36 53.33,38.88 53.91,39.47 ; v1(54.02,73.87) 59.92,73.87 60.72,74.67 60.72,75.49 C54.2 58.93,79.28 59.73,80.08 59.73,81.17 ; v1(54.82,57.07) 54.82,56.27 55.22,55.87 ; 59.73,81.17 R3.1 66.03,87.48 70.51,87.48 CONNECT.8 78.19,92.92 v1(78.19,102.65) ; 59.73,81.17 59.33,81.58 58.93,81.58 58.53,81.97 58.53,82.78 57.73,83.58 57.73,93.17 57.25,93.66 43.89,93.66 R27.1 40.88,90.93 R28.2 36.88,94.93 36.08,94.93 ; 35.66,8.7 35.23,8.7 R8.1 ; 35.66,8.7 C30.1 C30.2 40.27,10.1 40.62,10.45 ; 58.48,23.44 U5.3 ; 58.48,23.44 58.48,23.04 59.68,21.84 59.68,20.65 60.08,20.25 65.42,20.25 66.38,21.21 66.38,20.81 66.78,20.41 67.58,20.41 67.98,20.81 69.58,20.81 ; U9.8 31.71,122.94 37.94,116.71 37.94,113.51 PMODE2.1 37.28,110.16 37.28,96.13 36.08,94.93 ; 40.62,10.45 40.62,10.05 47.42,3.25 49.34,3.25 SW1.8 ; 69.58,20.81 71.18,20.81 71.98,20.01 ; 69.58,20.81 68.78,21.61 68.78,25.61 71.24,28.07 U6.8 ; 53.62,55.47 54.82,55.47 55.22,55.87 ; 9.03,87.22 10.23,87.22 11.03,88.02 U8.4 11.03,97.56 13.43,99.96 U8.18 13.43,101.43 13.97,101.96 16.37,101.96 v1(17.7,100.63) ; 9.03,87.22 9.03,85.86 R15.1 8.26,83.42 R14.2 ; 51.91,36.67 52.31,36.67 53.11,37.47 ; 51.91,36.67 v1(51.82,36.57) ; 51.91,36.67 51.22,36.67 C7.2 ; 55.22,55.87 55.62,55.87 56.02,55.47 63.62,55.47 67.22,51.87 67.22,51.21 L1.2 67.37,49.53 C15.2 69.76,47.14 v1(71.36,47.14) 72.08,47.14 C14.2 74.13,49.09 81.72,49.09 HEADER.25 ; v1(71.36,60.34) 71.36,62.25 R41.1 ; 36.08,94.93 30.08,94.93 28.08,96.93 25.74,96.93 C22.2 22.54,95.78 C23.2 v1(21.7,97.43) ; 3v3.1 31.63,40.39 v1(33.65,40.39) ; 71.98,20.01 72.91,20.01 C20.2 ; v1(82.43,106.76) 82.43,106.82 R16.1
  Inner1 w0.4: v1(71.36,47.14) v1(71.36,60.34) ; v1(51.82,36.57) v1(51.82,32.17) ; v1(82.43,106.76) 82.3,106.76 v1(78.19,102.65) ; v1(54.02,73.87) 50.82,70.67 v1(50.02,70.67)
  Inner4 w0.22: 58.9,43.28 v1(58.71,43.28) ; 58.9,43.28 59.91,43.28 ; 58.9,43.28 54.5,47.68 54.5,48.48 54.9,48.88 58.69,48.88 58.9,48.67 ; v1(59.3,51.87) 59.3,49.07 58.9,48.67 ; 58.9,48.67 v1(58.9,48.27)
  Inner4 w0.4: v1(68.96,42.09) 71.36,44.49 v1(71.36,47.14)
  Bottom Layer w0.4: v1(33.65,40.39) 36.48,40.39 v1(37.62,39.24) 35.87,39.24 U10.11 ; v1(21.7,97.43) 18.5,100.63 v1(17.7,100.63) ; v1(54.82,57.07) v1(48.42,63.47)
  vias: v1(47.06,14.86) v1(48.46,14.01) v1(48.93,20.52) v1(49.69,18.01) v1(51.09,16.39) v1(51.19,13.15) v1(52.84,18.13) v1(53.19,15.15) v1(53.19,13.15) v1(55.19,17.15) v1(55.19,15.15) v1(55.19,13.15) v1(57.19,19.15) v1(57.19,17.15) v1(57.19,15.15) v1(57.19,13.15) v1(59.19,17.15) v1(59.19,15.15) v1(59.19,13.15) v1(61.19,15.15) v1(61.19,13.15) v1(63.19,13.15)
3V3V: length 404.1
  Top Layer w0.22: v1(24.15,81.54) 25.35,82.74 ; 25.35,82.74 26.95,84.34 ; 25.35,82.74 23.51,84.58 ; 30.55,84.34 30.55,84.34 26.95,84.34 26.95,84.34 ; 30.55,84.34 30.95,83.94 30.95,81.54 29.84,80.43 VIDEO.5 ; 30.55,84.34 31.51,84.34 31.91,84.74 32.71,84.74 ; 30.55,84.34 26.95,84.34 ; 38.92,78.44 38.92,81.64 ; 38.92,78.44 40.12,77.24 40.12,74.04 39.32,73.24 ; 38.92,78.44 38.51,78.03 VIDEO.50 ; 38.92,81.64 39.32,82.04 40.94,82.04 C50.2 ; 38.92,81.64 38.53,82.03 VIDEO.60 ; VIDEO.15 28.95,76.43 30.55,74.83 VIDEO.24 30.55,72.13 30.95,71.73 ; 27.75,68.53 30.95,71.73 ; 27.75,68.53 24.15,68.53 v1(23.75,68.13) ; 27.75,68.53 27.75,67.19 v1(32.95,61.99) ; 30.95,71.73 31.75,71.73 32.55,72.53 VIDEO.29 ; 23.51,84.58 26.47,84.58 26.71,84.34 26.95,84.34 ; 23.51,84.58 C49.2 ; 38.92,66.84 38.92,72.04 39.32,72.44 39.32,73.24 ; 34.31,83.94 35.51,83.94 35.75,83.7 VIDEO.64 ; 34.31,83.94 34.31,84.34 33.91,84.74 32.71,84.74 ; 34.31,83.94 33.91,83.54 33.91,83.3 ; 32.71,84.74 32.71,86.65 C51.2 ; VIDEO.41 38.05,74.11 38.92,73.24 39.32,73.24 ; 33.91,83.3 33.98,83.3 VIDEO.68 ; 33.91,83.3 VIDEO.69
  Top Layer w0.4: C50.2 41.32,83.01 C34.2 ; v1(49.2,89.63) 50,89.63 50.8,88.83 ; U15.8 53.12,69.98 55.12,67.98 55.12,67.58 55.52,67.18 59.25,67.18 C45.2 68.14,58.29 R42.1 ; U15.8 51.12,69.98 49.12,67.98 49.12,62.05 U14.3 ; U15.8 51.98,70.04 C53.2 53.18,72.83 53.18,81.06 U16.8 51.79,82.45 51.79,85.43 ; C43.2 50.51,88.83 50.8,88.83 ; 23.61,50.8 23.61,56.04 U13.4 U13.2 32.95,59.19 v1(32.95,61.99) ; 23.61,50.8 21.21,50.8 19.21,48.8 19.21,44.64 30.43,33.42 ; 23.61,50.8 24.01,50.4 C32.2 24.81,48.4 28.41,48.4 29.01,49 C33.2 ; 30.43,33.42 33.21,30.64 35.21,30.64 C70.1 40.3,25.54 40.3,16.88 C71.1 v1(35.9,12.48) ; 30.43,33.42 31.5,34.49 3v3v.1 ; C51.2 33.29,86.83 v1(34.49,88.03) ; L3.2 20.55,83.78 22.71,83.78 23.51,84.58 ; 50.8,88.83 50.8,86.43 51.79,85.43 ; R12.2 27.23,96.19 26.63,95.59 26.63,93.19 C42.2 28.31,91.52 28.31,85.14 27.51,84.34 ; 51.79,85.43 52.19,85.43 v1(52.99,86.23) ; v1(35.35,67.59) 36.97,67.59 C37.2 39.12,66.84 C38.2 ; v1(76.95,85.02) 76.95,85.54 C35.2 81.06,85.65 81.86,86.45 81.86,86.9 C36.2 82.08,101.12 86.26,105.3 86.26,116.68 R17.1
  Inner1 w0.22: v1(23.75,68.13) 23.35,68.53 23.35,80.74 v1(24.15,81.54)
  Inner1 w0.4: v1(35.35,67.59) 32.95,65.19 v1(32.95,61.99)
  Inner4 w0.4: v1(72.15,82.62) 74.55,82.62 v1(76.95,85.02)
  Bottom Layer w0.4: PMODE1.2 29.5,12.48 v1(35.9,12.48) 45.11,3.28 62,3.28 SW2.8 ; v1(72.15,82.62) 67.75,82.62 66.55,83.82 65.76,83.03 56.19,83.03 v1(52.99,86.23) ; v1(49.2,89.63) 48.8,89.23 47.69,89.23 46.49,88.03 v1(34.49,88.03)
  vias: v1(13.66,53.92) v1(15.66,53.92) v1(17.66,53.92) v1(21.66,57.92) v1(21.66,55.92) v1(21.66,53.92) v1(22.77,53.16)
+5V: length 278.3
  Top Layer w0.4: v1(22.18,48.54) 22.18,48.52 U17.1 23.72,43.16 23.72,41.69 5v.1 ; 36.18,60.14 36.58,59.74 45.78,59.74 46.18,59.34 48.31,59.34 U14.1 ; 36.18,60.14 F1.1 ; 36.18,60.14 31.38,55.34 28.98,55.34 v1(26.98,53.34) ; 58.34,28.29 60.39,26.25 U5.1 ; 58.34,28.29 52.9,33.74 v1(48.1,33.74) ; 58.34,28.29 58.37,28.32 v1(59.69,28.32) ; USB1.2 7.51,113.53 v1(7.91,113.12) ; v1(76.2,14.35) 77.85,14.35 BAT.1 ; U9.5 30.49,119.63 v1(29.91,119.63) ; v1(7.91,107.61) 7.91,108.01 7.19,108.72 USB1.11
  Inner1 w0.4: v1(7.91,113.12) 23.4,113.12 v1(29.91,119.63) ; v1(59.69,28.32) 59.69,23.5 60.11,23.08 60.11,21.41 60.75,20.76 62.42,20.76 v1(68.07,15.11)
  Inner4 w0.4: POWM.2 POWV.2 48.1,20.16 v1(48.1,33.74) 39.7,42.14 39.7,46.94 33.3,53.34 v1(26.98,53.34) ; v1(7.91,107.61) v1(7.91,113.12)
  Bottom Layer w0.4: v1(22.18,48.54) v1(26.98,53.34) 26.98,54.54 5.91,75.61 5.91,103.61 8.11,105.81 8.11,106.21 7.91,106.41 v1(7.91,107.61) ; v1(76.2,14.35) 68.83,14.35 v1(68.07,15.11)
GND: length 839.8
  Top Layer w0.22: C51.1 32.67,87.89 v1(32.24,87.89) ; MAIN.81 53.9,44.37 53.1,44.37 52.1,43.37 MAIN.62 52.1,39.97 51.3,39.17 51.3,37.97 50.5,37.17 50.5,36.37 51.04,35.83 C7.1
  Top Layer w0.254: VIDEO.62 36.55,82.45 36.66,82.34 36.92,82.34 ; 36.92,82.34 37.32,82.34 38.88,83.9 41.68,83.9 42.08,83.5 42.08,83.1 ; 36.92,82.34 36.92,81.54 33.61,78.23 VIDEO.81
  Top Layer w0.3: 7.73,71.14 7.33,70.74 7.33,69.94 7.63,69.64 ; 7.73,71.14 HDMI.8 ; 7.73,71.14 7.73,71.35 7.33,71.75 7.33,72.15 7.73,72.55 ; 7.63,68.14 HDMI.2 ; 7.63,68.14 7.63,67.34 8.43,66.54 8.43,65.03 HDMI.21 ; 7.63,68.14 7.63,69.64 ; v1(7.33,72.95) 7.73,72.55 ; 7.73,72.55 7.82,72.64 HDMI.11 ; 7.63,69.64 HDMI.5
  Top Layer w0.4: 54.49,57.9 52.89,56.3 52.89,55.1 ; 54.49,57.9 55.29,57.9 55.69,57.5 v1(59.29,57.5) ; 54.49,57.9 54.09,58.3 54.09,58.7 ; USB1.12 6.14,107.75 6.14,106.81 ; U8.21 11.03,101.48 12.12,102.57 16.12,102.57 17.32,103.77 ; 21.4,29.01 U10.6 ; 29.91,47.45 29.91,47.05 U7.4 35.49,41.47 C24.1 ; 29.91,47.45 29.91,49.45 29.36,50 ; 29.91,47.45 24.71,47.45 23.17,48.99 23.17,49.2 ; 52.89,55.1 53.29,54.7 53.69,54.7 ; 52.89,55.1 52.42,54.63 C3.1 C2.1 C1.1 ; 41.66,68.17 41.66,67.89 39.64,65.87 C38.1 37.85,65.87 C37.1 35.94,66 C48.1 34.24,67.09 v1(33.84,67.09) U11.2 ; 41.66,68.17 42.46,67.37 42.86,67.37 44.06,66.17 U15.4 ; 41.66,68.17 41.32,68.5 C39.1 ; 21.84,89.78 20.64,88.59 ; 21.84,89.78 21.84,93.03 20.86,94.01 C23.1 20.86,98.03 X1.2 ; 21.84,89.78 23.04,89.78 23.44,90.19 v1(27.44,90.19) 27.44,90.98 C42.1 ; 20.64,88.59 R11.1 ; 20.64,88.59 19.44,87.39 ; 76.22,86.05 75.33,85.16 67.75,85.16 CONNECT.9 ; 76.22,86.05 C35.1 76.22,80.9 RSTP.3 v1(77.02,76.82) ; 76.22,86.05 77.29,87.12 C36.1 ; 43.8,75.2 42.16,76.84 C44.1 ; 43.8,75.2 46.46,72.54 46.46,71.37 ; 43.8,75.2 44.2,75.2 45.8,76.8 45.8,82.8 44.6,84 ; PCS.4 4.25,43.53 4.25,43.83 ; USB1.14 USB1.14 6.14,106.81 ; 42.51,82.8 42.37,82.8 42.08,83.1 ; 42.51,82.8 43.31,83.6 43.71,83.6 44.11,84 44.6,84 ; 42.51,82.8 42.51,82 C50.1 ; 8.44,36.47 USB2.5 ; 8.44,36.47 13.69,36.47 ; 8.44,36.47 7.64,37.27 7.64,39.67 USB2.5 5.08,43.83 4.25,43.83 ; 44.6,84 46.8,86.21 ; C71.2 42.36,14.73 C69.2 42.23,20.83 42.23,27.81 44.82,30.4 44.82,35.43 ; C24.1 32.64,39.24 GND.1 ; C24.1 36.35,38.39 39.06,38.39 39.46,38.79 ; 25.05,120.21 23.05,122.21 ; 25.05,120.21 23.05,118.21 23.05,114.32 ; 25.05,120.21 25.45,120.21 U9.3 ; 23.05,122.21 24.65,123.81 26.65,123.81 29.05,121.41 29.05,119.41 31.45,117.01 35.5,117.01 R43.2 ; 23.05,122.21 18.89,126.37 RSTA.3 ; 29.36,50 28.56,50 28.17,49.61 28.17,49.2 ; 29.36,50 29.36,53.3 U13.1 ; 76.89,71.1 RSTP1.3 ; 76.89,71.1 v1(77.02,71.22) ; 76.89,71.1 75.29,69.5 75.29,67.1 ; 54.09,58.7 54.09,61.14 58.99,66.04 ; 54.09,58.7 51.7,61.09 U14.2 48.71,61.09 47.91,61.89 47.91,62.69 44.86,65.74 U15.4 ; U1.2 69.43,32.3 C17.1 67.73,26.61 65.38,24.26 ; 21.45,102.22 21.35,102.22 X1.4 19.07,102.32 C28.2 17.32,103.77 ; 21.45,102.22 23.05,103.82 23.05,112.62 23.45,113.02 23.45,113.92 23.05,114.32 ; 21.45,102.22 23.05,100.62 X1.2 ; 62.82,49.43 61.62,50.63 60.15,50.63 MAIN.81 ; 62.82,49.43 62.82,49.03 63.62,48.23 63.62,48.21 C19.1 67.69,47.81 C15.1 69.25,46.25 C14.1 78.76,46.25 HEADER.26 ; 62.82,49.43 63.22,49.83 C9.1 v1(62.16,54.63) C8.1 C6.1 ; C18.1 68.9,35.92 U1.4 65.14,36.34 v1(65.11,36.34) ; 44.82,35.43 46.02,35.43 C11.1 C12.1 49.96,35.83 50.5,36.37 ; 44.82,35.43 42.82,35.43 39.46,38.79 ; 17.04,86.19 18.24,86.19 19.44,87.39 ; 17.04,86.19 11.83,91.4 11.83,92.02 ; 17.04,86.19 16.64,85.78 16.64,84.59 ; 4.25,49.83 3.85,49.83 PCS.5 ; 4.25,49.83 9.46,49.83 R32.1 12.96,49.77 R33.1 ; 4.25,49.83 4.25,43.83 ; C53.1 49.19,71.63 49.19,71.96 48.72,72.43 47.52,72.43 46.46,71.37 ; BOOTSELV.3 76.05,59.1 71.29,59.1 70.49,59.9 70.49,63.1 ; 6.14,106.81 R4.1 14.29,106.81 17.32,103.77 ; C41.1 31.1,86.83 30.7,87.23 30.7,87.95 31.1,88.35 32.19,88.35 32.24,88.3 v1(32.24,87.89) ; PCS1.4 4.25,54.71 4.25,60.61 PCS1.5 2.61,62.25 HDMI.23 2.75,65.03 8.43,65.03 ; C47.1 29.01,68.8 U11.4 31.04,69.31 v1(31.04,69.89) ; 23.05,114.32 21.85,115.52 15.61,115.52 R5.1 8.02,113.92 7.22,114.72 6.81,114.72 ; C49.1 22.24,84.58 19.44,87.39 ; U4.1 54.12,28.25 55.04,28.25 59.44,23.85 U5.2 59.44,23.09 60.27,22.26 62.67,22.26 U6.4 65.38,24.26 ; X1.2 25.49,100.62 C29.2 ; 70.49,63.1 v1(64.49,63.1) ; 70.49,63.1 74.49,67.1 75.29,67.1 ; USB2.5 14.94,39.97 USB2.4 13.69,36.47 ; C5.1 55.95,54.7 53.69,54.7 ; 75.29,67.1 BOOTSELM.3 ; 59.11,35.94 59.52,35.94 C16.1 ; 59.11,35.94 58.71,35.54 56.31,35.54 C13.1 C10.1 C7.1 ; 59.11,35.94 v1(59.11,37.94) ; 53.69,54.7 C4.1 ; 5.79,12.69 6.72,12.69 R2.1 ; v1(6.97,78.19) 8.17,79.39 HDMI.20 8.64,79.39 13.84,84.59 16.64,84.59 ; 65.38,24.26 67.22,22.41 C63.2 ; 13.69,36.47 13.94,36.47 USB2.5 ; 6.81,114.72 6.08,115.45 USB1.13 USB1.13 ; 6.81,114.72 6.71,114.72 USB1.1 ; 39.46,38.79 C25.1 ; 46.8,86.21 49.57,86.21 C52.1 49.59,88.75 C43.1 ; 46.8,86.21 C31.1 ; HDMI.21 12.78,64.89 17.34,60.33 ; 16.64,84.59 19.44,81.78 ; 46.46,71.37 46.46,66.97 45.66,66.17 U15.4 ; 19.44,81.78 R22.1 ; 19.44,81.78 20.45,80.77 C40.1
  Top Layer w0.6: U1.2 69.33,32.65 69.07,32.65 67.63,34.09 67.63,34.65
  Top Layer w0.7: 72.58,22.15 C20.1 ; 72.58,22.15 72.83,22.41 74.88,22.41 75.44,21.84 75.44,18.09 74.36,17.02 C67.2 ; 72.58,22.15 72.58,23.28 72.69,23.39 73.68,23.39 75.06,24.77 75.06,34.42 74.04,35.43 73.06,35.43 72.9,35.27 72.9,35.27 70.17,32.55 U1.2
  Top Layer w0.8: U10.12 23.61,29.01 21.4,29.01 USB2.5 ; 77.29,87.12 77.29,87.25 79.56,89.52 79.56,106.14 79.59,106.17 CLED1.1 79.59,106.3 POWERMAIN.1 CLED2.1 POWERVIDEO.1 79.59,122.36 SCREW1#2.1 ; SCREW1#4.1 5.79,5.15 5.79,12.69 5.39,12.69 U10.14 U10.13 6.56,34.97 USB2.5 ; BAT.2 82.8,5.3 SCREW1#3.1 82.46,4.96 73.86,4.96 ; 6.08,115.45 6.08,125.72 SCREW1.1 ; 73.86,4.96 73.86,6.16 74.11,6.41 C66.2 74.36,10.67 C67.2 ; 73.86,4.96 C68.2 ; PCS1.4 PCS.5
  Inner1 w0.22: v1(32.24,87.89) 32.24,85.5 30.24,83.5 30.24,70.7 v1(31.04,69.89)
  Inner1 w0.3: v1(7.33,72.95) 9.37,74.99 9.37,75.79 v1(6.97,78.19)
  Inner1 w0.4: 62.09,54.7 v1(62.16,54.63) ; 62.09,54.7 v1(59.29,57.5) ; 62.09,54.7 63.29,55.9 63.29,61.9 v1(64.49,63.1) ; v1(77.02,71.22) v1(77.02,76.82) ; v1(33.84,67.09) v1(31.04,69.89)
  Inner4 w0.4: v1(6.97,78.19) 3.81,78.19 HDMI.22 ; v1(65.11,36.34) 65.02,36.24 60.81,36.24 v1(59.11,37.94)
  Bottom Layer w0.4: v1(27.44,90.19) 28.24,90.19 30.53,87.89 v1(32.24,87.89)
  vias: v1(2.99,117.1) v1(2.99,113.1) v1(2.99,111.1) v1(2.99,109.1) v1(2.99,105.1) v1(2.99,85.55) v1(2.99,83.55) v1(2.99,81.55) v1(2.99,77.55) v1(2.99,75.55) v1(2.99,73.55) v1(2.99,71.55) v1(2.99,69.55) v1(2.99,67.55) v1(4.99,117.1) v1(4.99,105.1) v1(4.99,85.55) v1(4.99,83.55) v1(4.99,81.55) v1(4.99,79.55) v1(4.99,77.55) v1(4.99,75.55) v1(4.99,73.55) v1(4.99,71.55) v1(4.99,69.55) v1(4.99,67.55) v1(4.99,65.55) v1(6.99,117.1) v1(8.97,107.1) v1(8.97,105.1) v1(9.09,114.86) v1(10.97,107.1) v1(11.09,116.86) v1(11.09,114.86) v1(12.07,34.23) v1(13.09,116.86) v1(15.09,116.86) v1(18.07,38.74) v1(18.07,36.74) v1(18.07,34.74) v1(22.07,38.74) v1(22.07,36.74) v1(22.07,34.74) v1(24.07,36.74) v1(24.07,34.74)
CLK: length 120.5
  Top Layer w0.254: U8.12 15.73,95.91 15.1,95.91 14.59,95.4 v1(14.59,94.9)
  Inner1 w0.254: SW1.5 25.26,19.71 25.26,84.23 v1(14.59,94.9)
  Bottom Layer w0.254: SW2.5 54.51,0.66 44.31,0.66 SW1.5
CS0: length 62.3
  Top Layer w0.254: U8.14 15.79,97.57 15.24,97.57 13.97,96.3 13.97,94.52 14.22,94.27 14.22,93.76 15.24,92.74 v1(15.75,92.74)
  Inner1 w0.254: v1(15.75,92.74) 15.75,68.36 PCS1.3 2.79,55.66 1.02,53.88 1.02,46.51 PCS.3
D+: length 47.8
  Top Layer w0.22: v1(12.13,41.85) 10.35,43.63 D11.2 ; MAIN.67 54.1,41.79 v1(54.04,41.85)
  Bottom Layer w0.22: v1(54.04,41.85) 53.27,41.09 17.21,41.09 15.94,42.36 14.92,42.36 14.16,41.6 12.38,41.6 v1(12.13,41.85)
D-: length 52.4
  Top Layer w0.22: v1(8.14,42.36) 7.38,43.12 D11.1 ; v1(53.7,40.3) MAIN.66
  Bottom Layer w0.22: v1(53.7,40.3) 54.62,41.23 54.62,42.11 54.11,42.62 53.86,42.62 52.84,41.6 17.28,41.6 16.01,42.87 8.65,42.87 v1(8.14,42.36)
GPIO2: length 47.8
  Top Layer w0.22: v1(54.07,37.76) 54.33,38.02 56.87,38.02 58.9,40.05 MAIN.79
  Bottom Layer w0.22: 23.94,19.17 22.67,20.44 22.67,21.6 38.83,37.76 v1(54.07,37.76)
GPIO2V: length 18.5
  Top Layer w0.22: VIDEO.79 29.75,82.29 v1(29.5,82.04) ; 20.1,70.87 20.61,70.87 v1(20.86,71.12)
  Bottom Layer w0.22: v1(20.86,71.12) 25.18,75.44 27.46,75.44 30.26,78.23 30.26,81.28 v1(29.5,82.04)
GPIO3: length 44.5
  Top Layer w0.22: MAIN.80 59.3,39.54 57.01,37.26 v1(54.73,37.26)
  Bottom Layer w0.22: v1(54.73,37.26) 38.67,21.2 U10.9
GPIO3V: length 14.3
  Top Layer w0.22: v1(28.86,82.68) 28.88,82.68 VIDEO.80 ; v1(24.03,75.69) 22.51,74.17 D9.2
  Bottom Layer w0.22: v1(28.86,82.68) 28.86,80.52 27.9,79.56 27.9,79.52 24.27,75.89 24.23,75.89 v1(24.03,75.69)
GPIO4V: length 18.2
  Top Layer w0.22: D3.2 20.73,69.22 22.26,69.22 27.34,74.3 v1(27.34,74.8) ; v1(27.48,82.06) 28.22,82.06 VIDEO.1
  Inner4 w0.22: v1(27.48,82.06) 28.1,81.43 28.1,75.56 v1(27.34,74.8)
GPIO5V: length 16.8
  Top Layer w0.22: 22.13,69.85 22.13,70.61 23.1,71.58 23.1,73.96 25.34,76.2 v1(27.21,76.2) ; VIDEO.2 28.89,81.63 v1(29.5,81.03)
  Bottom Layer w0.22: v1(27.21,76.2) 28.23,77.22 28.23,78.99 29.5,80.26 v1(29.5,81.03)
GPIO6V: length 20
  Top Layer w0.22: VIDEO.3 27.26,81.23 v1(27.21,81.28)
  Top Layer w0.254: v1(20.81,66.85) 20.65,66.85 20.1,66.29
  Inner4 w0.22: v1(27.21,81.28) 26.96,81.53 26.19,81.53 25.69,81.03 25.69,74.93 20.81,70.06 v1(20.81,66.85)
GPIO7V: length 17.7
  Top Layer w0.22: 28.24,80.83 27.78,80.83 27.46,80.52 26.7,80.52 v1(26.45,80.77) ; 20.61,67.56 v1(21.62,68.58)
  Inner4 w0.22: v1(26.45,80.77) 26.45,73.41 v1(21.62,68.58)
GPIO8V: length 10.6
  Top Layer w0.22: v1(27.34,79.76) 27.61,80.03 VIDEO.6
  Top Layer w0.254: D5.2 20.73,73.31 21.78,74.36 21.78,74.86 23.37,76.45 v1(24.03,76.45)
  Bottom Layer w0.22: v1(24.03,76.45) v1(27.34,79.76)
GPIO9V: length 11.9
  Top Layer w0.22: D6.2 23.64,77.21 26.83,77.21 v1(27.08,76.95) ; v1(29.11,78.98) 29.11,79.38 28.86,79.63 VIDEO.7
  Inner1 w0.22: v1(27.08,76.95) v1(29.11,78.98)
GPIO10: length 71.7
  Top Layer w0.22: v1(63.69,46.74) 61.93,44.97 MAIN.8
  Inner4 w0.22: v1(63.69,86.87) 63.44,86.61 63.44,46.99 v1(63.69,46.74)
  Bottom Layer w0.4: v1(63.69,86.87) 60.39,86.87 MATRIX.16
GPIO10V: length 22.4
  Top Layer w0.22: VIDEO.8 27.59,79.23 27.48,79.12 19.09,79.12 R22.2
  Top Layer w0.254: R22.2 15.68,80.78 12.89,80.78 9.33,77.23 HDMI.19
GPIO11: length 69.4
  Top Layer w0.22: MAIN.9 61.17,45.37 v1(61.41,45.61)
  Inner4 w0.22: v1(61.41,45.61) 60.64,46.37 60.64,89.15 MATRIX.15
GPIO11V: length 31.2
  Top Layer w0.22: v1(12.12,78.95) 12.49,78.58 27.48,78.58 27.73,78.83 28.24,78.83
  Top Layer w0.254: HDMI.16 v1(7.55,75.14) ; v1(9.84,83.01) 9.84,85.02 R15.2
  Inner4 w0.22: 10.6,78.95 v1(12.12,78.95)
  Inner4 w0.254: v1(7.55,75.14) 7.55,75.9 10.6,78.95 10.6,82.25 v1(9.84,83.01)
GPIO12: length 79.8
  Top Layer w0.22: MAIN.11 61.14,46.17 62.68,47.71 62.68,48.51 v1(61.41,49.78)
  Inner4 w0.22: 43.37,116.59 61.08,98.88 61.08,50.11 v1(61.41,49.78)
GPIO12V: length 28.5
  Top Layer w0.22: VIDEO.11 11.52,78.03 v1(11.36,78.19)
  Top Layer w0.254: v1(9.08,81.1) R14.1 ; HDMI.15 v1(11.11,74.64)
  Bottom Layer w0.22: 10.6,78.7 10.85,78.7 v1(11.36,78.19)
  Bottom Layer w0.254: v1(11.11,74.64) 10.34,75.4 10.34,78.45 10.6,78.7 10.6,79.83 9.33,81.1 v1(9.08,81.1)
GPIO13: length 84.2
  Top Layer w0.22: v1(61.88,48.35) 61.88,47.59 60.86,46.57 60.41,46.57
  Inner1 w0.22: 62.04,48.19 62.04,48.01 ; 62.04,48.19 v1(61.88,48.35) ; 62.04,48.19 62.04,50.55 v1(64.07,52.58)
  Inner4 w0.22: v1(64.07,52.58) 63.82,52.83 63.82,70.87 64.32,71.37 64.32,98.81 56.7,106.43 56.7,112.78 60.51,116.59 67.37,116.59
GPIO13V: length 38.1
  Top Layer w0.22: 9.64,75.7 21.07,75.7 23.01,77.63 VIDEO.12
  Top Layer w0.254: R23.2 8.88,88.77 7.61,88.77 6.34,87.5 6.34,77.22 7.87,75.7 9.64,75.7 9.58,75.64 HDMI.17
GPIO14: length 86.9
  Top Layer w0.22: v1(59.61,46.47) 59.48,46.59 59.48,46.85 59.61,46.97 MAIN.13
  Inner4 w0.22: MATRIX.10 62.93,99.57 62.93,46.23 61.64,44.94 61.14,44.94 v1(59.61,46.47)
GPIO15: length 69.2
  Top Layer w0.22: v1(59.11,47.37) MAIN.14
  Inner1 w0.4: v1(60.01,74.93) 60.71,75.63 60.71,104.84 MATRIX.4
  Inner4 w0.22: v1(59.11,47.37) 59.37,47.37 60.26,48.26 60.26,74.68 v1(60.01,74.93)
GPIO16: length 65.2
  Top Layer w0.22: v1(61.28,49.02) 61.28,48.26 61.19,48.17 MAIN.16
  Inner1 w0.4: v1(61.78,73.41) 61.21,73.98 61.21,102.81 MATRIX.3
  Inner4 w0.22: v1(61.78,73.41) 61.53,73.15 61.53,50.55 62.04,50.04 62.04,49.53 61.53,49.02 v1(61.28,49.02)
GPIO17: length 71.1
  Top Layer w0.22: v1(59.63,48.59) 60.39,48.59 MAIN.17
  Inner4 w0.22: v1(59.63,48.59) 59.88,48.84 59.88,58.93 59.37,59.44 59.37,75.18 59.88,75.69 v1(59.88,88.39)
  Bottom Layer w0.4: MATRIX.13 52.01,102.87 52.01,96.27 v1(59.88,88.39)
GPIO26: length 46.4
  Top Layer w0.22: v1(58.42,86.12) 60.96,88.66 R34.2 ; v1(56.64,50.05) 56.9,50.31 MAIN.27
  Inner1 w0.22: v1(56.64,50.05) 57.4,50.82 v1(57.4,53.86)
  Inner4 w0.22: v1(57.4,53.86) 56.9,54.37 56.9,81.55 59.18,83.84 59.18,85.36 v1(58.42,86.12)
GPIO26V: length 88.7
  Top Layer w0.22: VIDEO.27 31.75,72.56 v1(31.49,72.31)
  Inner1 w0.22: v1(31.49,72.31) 44.45,59.35 v1(44.45,42.42)
  Inner4 w0.22: HEADER.1 84.07,18.54 84.07,20.58 83.56,21.09 65.78,21.09 v1(44.45,42.42)
GPIO27: length 46.2
  Top Layer w0.22: v1(58.42,83.96) 66.04,91.58 R35.2 ; v1(56.83,51.72) 56.5,51.39 MAIN.28
  Inner4 w0.22: v1(58.42,83.96) 56.5,82.04 56.5,52.06 v1(56.83,51.72)
GPIO27V: length 89.2
  Top Layer w0.22: v1(32.4,74.34) 32.15,74.09 VIDEO.28
  Inner4 w0.22: HEADER.3 81.71,18.71 66.44,18.71 61.36,23.79 59.07,23.79 40.27,42.59 40.27,47.16 36.21,51.23 36.21,62.66 32.4,66.47 v1(32.4,74.34)
GPIO28: length 43.3
  Top Layer w0.22: v1(53.98,78.38) 53.98,90.06 R36.2 ; v1(53.3,52.3) MAIN.36
  Inner4 w0.22: v1(53.98,78.38) 53.3,77.7 53.3,69.06 52.97,68.73 52.97,68.38 53.3,68.05 v1(53.3,52.3)
GPIO28V: length 81.1
  Top Layer w0.22: v1(38.14,67.74) 35.35,70.53 VIDEO.36
  Inner1 w0.22: v1(51.39,44.37) 53.17,42.59 57.23,42.59 79.08,20.75 79.08,19.48 79.84,18.71 80.85,18.71 81.62,19.48 81.62,21.16 HEADER.5
  Inner4 w0.22: v1(38.14,67.74) 38.14,67.02 44.28,60.88 44.28,51.48 v1(51.39,44.37)
GPIO29: length 54.2
  Top Layer w0.22: v1(59.31,82.31) 59.31,82.57 60.07,83.33 61.09,83.33 R37.2 ; v1(52.89,50.12) 52.89,50.88
  Inner4 w0.22: v1(59.31,82.31) 57.28,80.28 57.28,54.88 58.04,54.12 58.04,51.83 57.02,50.82 53.59,50.82 v1(52.89,50.12)
GPIO29V: length 81.6
  Top Layer w0.22: VIDEO.37 v1(35.75,74.09)
  Inner1 w0.22: v1(35.75,74.09) 35.75,71.04 45.65,61.13 45.65,54.53 46.42,53.77 v1(46.42,42.34)
  Inner4 w0.22: HEADER.7 81.71,23.79 65.43,23.79 46.88,42.34 v1(46.42,42.34)
GPIO30: length 46
  Top Layer w0.22: v1(47.75,70.37) 46.99,69.61 46.99,64.79 v1(47.75,64.02) ; R38.2 48.77,91.46 v1(49.28,90.95) ; v1(52.5,51.91) MAIN.38
  Inner1 w0.22: v1(48.01,76.72) 48.11,76.83 48.11,81.65 49.78,83.33 49.78,90.44 v1(49.28,90.95)
  Inner4 w0.22: v1(48.26,57.17) 47.75,57.67 v1(47.75,64.02)
  Bottom Layer w0.22: v1(47.75,70.37) 48.01,70.63 v1(48.01,76.72) ; v1(48.26,57.17) 48.77,57.17 52.5,53.44 v1(52.5,51.91)
GPIO30V: length 72.4
  Top Layer w0.22: VIDEO.38 36.15,72.82 37.16,71.8 v1(37.92,71.8)
  Inner4 w0.22: v1(37.92,71.8) 42.5,71.8 45.29,69.01 v1(47.58,69.01)
  Bottom Layer w0.22: v1(47.58,69.01) 58.5,58.08 59.52,58.08 79.07,38.53 79.07,37.26 79.83,36.49 80.85,36.49 81.61,35.73 81.61,32.18 82.37,31.41 83.39,31.41 84.15,30.65 84.15,28.78 HEADER.9
GPIO31: length 45.1
  Top Layer w0.22: MAIN.39 52.1,50.12 v1(52.07,50.09) ; v1(52.07,88.03) 53.34,89.3 R39.2
  Inner4 w0.22: v1(52.07,50.09) 51.89,50.27 51.89,72.97 50.55,74.31 50.55,86.5 v1(52.07,88.03)
GPIO31V: length 83.4
  Top Layer w0.22: VIDEO.39 v1(36.55,74.59)
  Inner1 w0.22: HEADER.2 78.46,19.33 78.46,19.98 68.55,29.89 68.04,29.89 63.47,34.46 63.47,35.22 62.45,36.24 61.69,36.24 59.15,38.78 59.15,39.03 57.37,40.81 54.07,40.81 48.48,46.4 48.48,48.18 v1(48.74,48.43)
  Inner4 w0.22: v1(36.55,74.59) 40.36,74.59 45.18,69.77 47.72,69.77 48.99,68.5 48.99,48.69 v1(48.74,48.43)
GPIO32: length 62.8
  Top Layer w0.22: v1(51.25,51.05) 51.53,51.05 MAIN.40
  Inner4 w0.22: MATRIX.14 42.36,107.95 42.36,106.17 49.98,98.55 49.98,74.17 51.5,72.64 51.5,51.31 v1(51.25,51.05)
GPIO32V: length 72.7
  Top Layer w0.22: v1(38.22,72.56) 37.71,72.56 VIDEO.40
  Inner1 w0.22: HEADER.4 80.39,20.74 79.11,22.02 79.11,25.07 54.98,49.2 54.98,49.7 56.25,50.97 56.25,53 v1(55.49,53.77)
  Bottom Layer w0.22: v1(55.49,53.77) 55.49,55.29 v1(38.22,72.56)
GPIO33: length 47
  Top Layer w0.22: v1(48.89,87.9) 45.08,91.71 R40.2 ; v1(49.66,49.37) MAIN.42
  Inner4 w0.22: v1(48.89,87.9) 49.4,87.39 49.4,72.15 50.67,70.88 50.67,63.34 50.34,63.01 50.34,50.05 v1(49.66,49.37)
GPIO33V: length 78.2
  Top Layer w0.22: 38.05,74.83 37.55,74.83 37.29,74.58 37.29,73.82 v1(37.55,73.56)
  Inner1 w0.22: v1(48.98,43.73) 52.02,40.69 52.02,39.67 51.77,39.42 51.77,39.16 68.45,22.48 v1(69.98,22.48)
  Inner4 w0.22: v1(37.55,73.56) 37.29,73.31 37.29,67.21 43.9,60.61 43.9,48.81 v1(48.98,43.73)
  Bottom Layer w0.22: v1(69.98,22.48) HEADER.6
GPIO34: length 52.5
  Top Layer w0.22: v1(55.16,48.21) 54.4,48.97 52.12,48.97 51.79,48.65 51.43,48.65 51.1,48.97 MAIN.43
  Inner4 w0.22: v1(55.16,48.21) 58.97,44.4 62.28,44.4 65.32,47.45 65.32,80.06 CONNECT.11
GPIO34V: length 68.5
  Top Layer w0.22: VIDEO.43 v1(38.82,75.23)
  Inner1 w0.22: v1(38.82,75.23) 39.32,75.23 60.66,53.9 60.66,44.75 HEADER.8
GPIO35: length 40.4
  Top Layer w0.22: HEADER.16 77.92,37.65 68.63,37.65 v1(67.1,36.13) ; MAIN.44 v1(49.58,48.57)
  Inner1 w0.22: v1(49.58,48.57) 49.32,48.32 49.32,48.07 49.07,47.81 49.07,47.56 53.64,42.99 57.45,42.99 64.82,35.62 66.59,35.62 v1(67.1,36.13)
GPIO35V: length 67.3
  Top Layer w0.22: VIDEO.44 v1(37.29,75.63)
  Bottom Layer w0.22: v1(37.29,75.63) 37.29,74.87 42.88,69.28 43.64,69.28 50.25,62.68 50.25,62.42 55.07,57.6 55.33,57.6 79.2,33.72 79.2,28.75 HEADER.10
